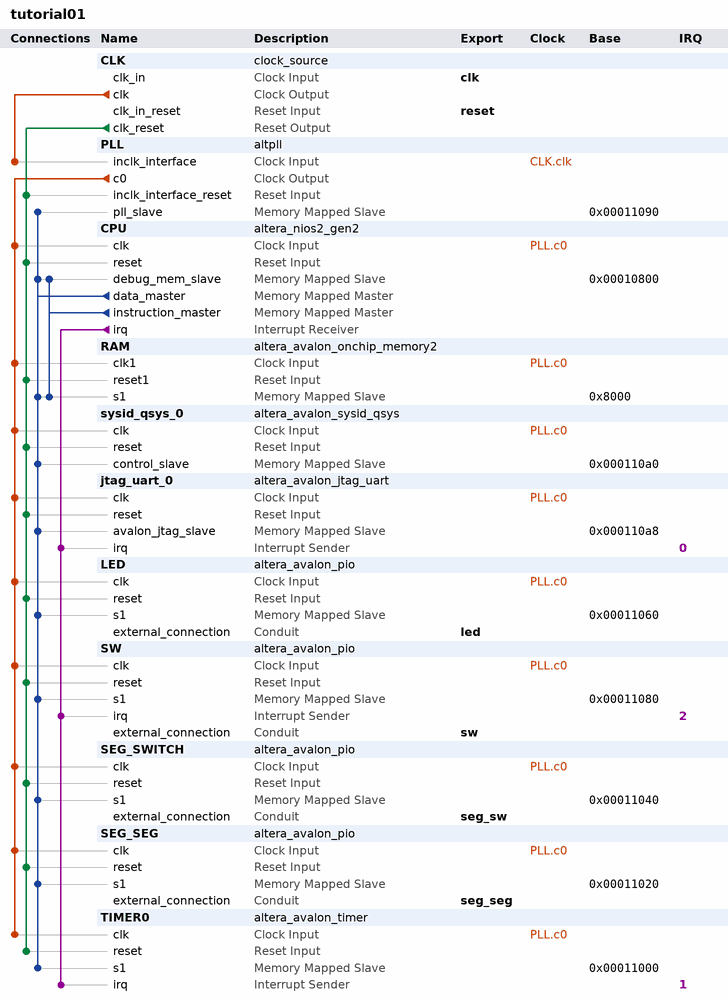
[diagram p0: system contents]
# Platform Designer (Qsys) system tutorial01, MAX 10 10M08DAF256C8G
# Parameters at their usual value, and those the tool derives, are not listed.
package require -exact qsys 18.1
create_system tutorial01
set_project_property DEVICE_FAMILY {MAX 10}
set_project_property DEVICE 10M08DAF256C8G

add_instance CLK clock_source 18.1
set_instance_parameter_value CLK clockFrequency 10000000

add_instance PLL altpll 18.1
set_instance_parameter_value PLL CLK0_DIVIDE_BY 1
set_instance_parameter_value PLL CLK0_MULTIPLY_BY 5
set_instance_parameter_value PLL INCLK0_INPUT_FREQUENCY 100000
set_instance_parameter_value PLL PORT_ARESET PORT_UNUSED
set_instance_parameter_value PLL PORT_LOCKED PORT_UNUSED
set_instance_parameter_value PLL PORT_clk1 PORT_UNUSED
set_instance_parameter_value PLL PORT_clk2 PORT_UNUSED
set_instance_parameter_value PLL PORT_clk3 PORT_UNUSED

add_instance CPU altera_nios2_gen2 18.1
set_instance_parameter_value CPU dcache_size 2048
set_instance_parameter_value CPU exceptionSlave RAM.s1
set_instance_parameter_value CPU icache_size 4096
set_instance_parameter_value CPU impl Tiny
set_instance_parameter_value CPU resetSlave RAM.s1

add_instance RAM altera_avalon_onchip_memory2 18.1
set_instance_parameter_value RAM dataWidth 32
set_instance_parameter_value RAM dualPort false
set_instance_parameter_value RAM initMemContent false
set_instance_parameter_value RAM initializationFileName onchip_mem.hex
set_instance_parameter_value RAM memorySize 32768

add_instance sysid_qsys_0 altera_avalon_sysid_qsys 18.1
set_instance_parameter_value sysid_qsys_0 id 305419896

add_instance jtag_uart_0 altera_avalon_jtag_uart 18.1
set_instance_parameter_value jtag_uart_0 simInteractiveOptions NO_INTERACTIVE_WINDOWS

add_instance LED altera_avalon_pio 18.1
set_instance_parameter_value LED bitModifyingOutReg true
set_instance_parameter_value LED direction Output
set_instance_parameter_value LED resetValue 10
set_instance_parameter_value LED width 4

add_instance SW altera_avalon_pio 18.1
set_instance_parameter_value SW captureEdge true
set_instance_parameter_value SW direction Input
set_instance_parameter_value SW edgeType FALLING
set_instance_parameter_value SW generateIRQ true
set_instance_parameter_value SW irqType EDGE
set_instance_parameter_value SW width 3

add_instance SEG_SWITCH altera_avalon_pio 18.1
set_instance_parameter_value SEG_SWITCH bitModifyingOutReg true
set_instance_parameter_value SEG_SWITCH direction Output
set_instance_parameter_value SEG_SWITCH width 4

add_instance SEG_SEG altera_avalon_pio 18.1
set_instance_parameter_value SEG_SEG bitModifyingOutReg true
set_instance_parameter_value SEG_SEG direction Output
set_instance_parameter_value SEG_SEG width 8

add_instance TIMER0 altera_avalon_timer 18.1
set_instance_parameter_value TIMER0 period 1
set_instance_parameter_value TIMER0 periodUnits MSEC

# connections
add_connection CLK.clk PLL.inclk_interface clock
add_connection PLL.c0 CPU.clk clock
add_connection PLL.c0 jtag_uart_0.clk clock
add_connection PLL.c0 LED.clk clock
add_connection PLL.c0 RAM.clk1 clock
add_connection PLL.c0 SEG_SEG.clk clock
add_connection PLL.c0 SEG_SWITCH.clk clock
add_connection PLL.c0 SW.clk clock
add_connection PLL.c0 sysid_qsys_0.clk clock
add_connection PLL.c0 TIMER0.clk clock
add_connection CLK.clk_reset CPU.reset reset
add_connection CLK.clk_reset jtag_uart_0.reset reset
add_connection CLK.clk_reset LED.reset reset
add_connection CLK.clk_reset PLL.inclk_interface_reset reset
add_connection CLK.clk_reset RAM.reset1 reset
add_connection CLK.clk_reset SEG_SEG.reset reset
add_connection CLK.clk_reset SEG_SWITCH.reset reset
add_connection CLK.clk_reset SW.reset reset
add_connection CLK.clk_reset sysid_qsys_0.reset reset
add_connection CLK.clk_reset TIMER0.reset reset
add_connection CPU.data_master CPU.debug_mem_slave avalon
set_connection_parameter_value CPU.data_master/CPU.debug_mem_slave baseAddress 0x00010800
add_connection CPU.data_master jtag_uart_0.avalon_jtag_slave avalon
set_connection_parameter_value CPU.data_master/jtag_uart_0.avalon_jtag_slave baseAddress 0x000110a8
add_connection CPU.data_master LED.s1 avalon
set_connection_parameter_value CPU.data_master/LED.s1 baseAddress 0x00011060
add_connection CPU.data_master PLL.pll_slave avalon
set_connection_parameter_value CPU.data_master/PLL.pll_slave baseAddress 0x00011090
add_connection CPU.data_master RAM.s1 avalon
set_connection_parameter_value CPU.data_master/RAM.s1 baseAddress 0x8000
add_connection CPU.data_master SEG_SEG.s1 avalon
set_connection_parameter_value CPU.data_master/SEG_SEG.s1 baseAddress 0x00011020
add_connection CPU.data_master SEG_SWITCH.s1 avalon
set_connection_parameter_value CPU.data_master/SEG_SWITCH.s1 baseAddress 0x00011040
add_connection CPU.data_master SW.s1 avalon
set_connection_parameter_value CPU.data_master/SW.s1 baseAddress 0x00011080
add_connection CPU.data_master sysid_qsys_0.control_slave avalon
set_connection_parameter_value CPU.data_master/sysid_qsys_0.control_slave baseAddress 0x000110a0
add_connection CPU.data_master TIMER0.s1 avalon
set_connection_parameter_value CPU.data_master/TIMER0.s1 baseAddress 0x00011000
add_connection CPU.instruction_master CPU.debug_mem_slave avalon
set_connection_parameter_value CPU.instruction_master/CPU.debug_mem_slave baseAddress 0x00010800
add_connection CPU.instruction_master RAM.s1 avalon
set_connection_parameter_value CPU.instruction_master/RAM.s1 baseAddress 0x8000
add_connection CPU.irq jtag_uart_0.irq interrupt
set_connection_parameter_value CPU.irq/jtag_uart_0.irq irqNumber 0
add_connection CPU.irq SW.irq interrupt
set_connection_parameter_value CPU.irq/SW.irq irqNumber 2
add_connection CPU.irq TIMER0.irq interrupt
set_connection_parameter_value CPU.irq/TIMER0.irq irqNumber 1

# exported interfaces
add_interface clk clock sink
set_interface_property clk EXPORT_OF CLK.clk_in
add_interface led conduit end
set_interface_property led EXPORT_OF LED.external_connection
add_interface reset reset sink
set_interface_property reset EXPORT_OF CLK.clk_in_reset
add_interface seg_seg conduit end
set_interface_property seg_seg EXPORT_OF SEG_SEG.external_connection
add_interface seg_sw conduit end
set_interface_property seg_sw EXPORT_OF SEG_SWITCH.external_connection
add_interface sw conduit end
set_interface_property sw EXPORT_OF SW.external_connection

set_interconnect_requirement {$system} qsys_mm.clockCrossingAdapter HANDSHAKE
set_interconnect_requirement {$system} qsys_mm.enableEccProtection FALSE
set_interconnect_requirement {$system} qsys_mm.insertDefaultSlave FALSE
set_interconnect_requirement {$system} qsys_mm.maxAdditionalLatency 1

save_system tutorial01.qsys
